# EAGLE design Measure-02 (EAGLE 6.2)
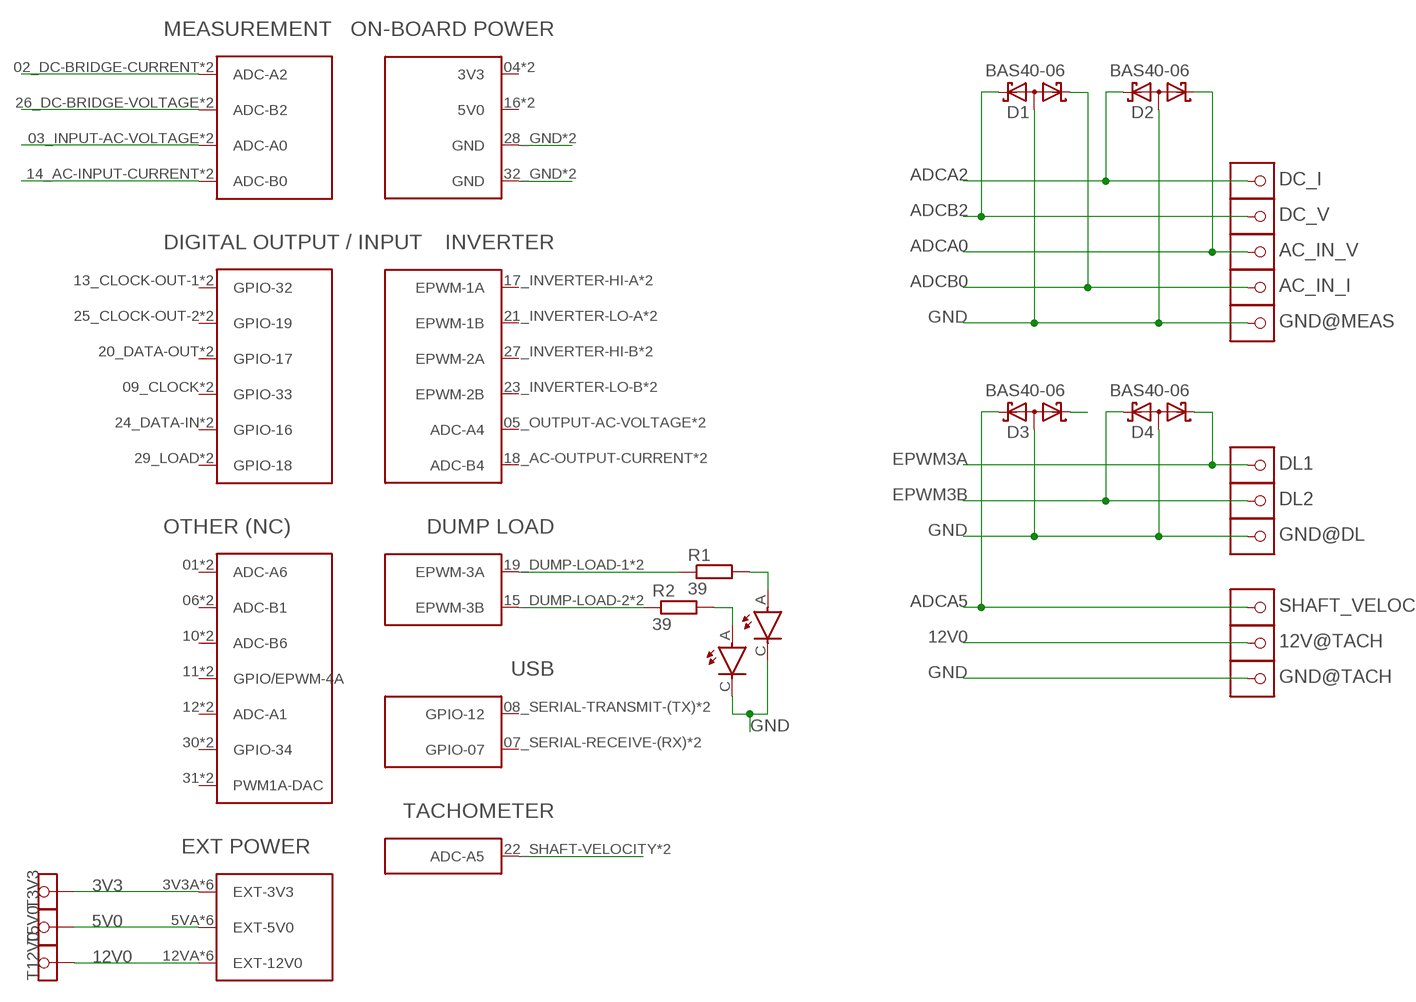
[diagram p0: schematic, sheet 1]

## Parts
12V@TACH  1X1HEADER(W/VIA)  [1X1HEADER(W/VIA)]
AC_IN_I  1X1HEADER(W/VIA)  [1X1HEADER(W/VIA)]
AC_IN_V  1X1HEADER(W/VIA)  [1X1HEADER(W/VIA)]
D1  BAS40-06  [SOT23]
D2  BAS40-06  [SOT23]
D3  BAS40-06  [SOT23]
D4  BAS40-06  [SOT23]
DC_I  1X1HEADER(W/VIA)  [1X1HEADER(W/VIA)]
DC_V  1X1HEADER(W/VIA)  [1X1HEADER(W/VIA)]
DL1  1X1HEADER(W/VIA)  [1X1HEADER(W/VIA)]
DL2  1X1HEADER(W/VIA)  [1X1HEADER(W/VIA)]
DL.1  PLCC2  [PLCC2]
DL.2  PLCC2  [PLCC2]
GND@DL  1X1HEADER(W/VIA)  [1X1HEADER(W/VIA)]
GND@MEAS  1X1HEADER(W/VIA)  [1X1HEADER(W/VIA)]
GND@TACH  1X1HEADER(W/VIA)  [1X1HEADER(W/VIA)]
R1  39  R-EU_R0805  [R0805]
R2  39  R-EU_R0805  [R0805]
SHAFT_VELOC  1X1HEADER(W/VIA)  [1X1HEADER(W/VIA)]
T3V3  TESTPAD  [TESTPAD]
T5V0  TESTPAD  [TESTPAD]
T12V0  TESTPAD  [TESTPAD]
U$1  CONTROLLER_STACK  [CONTROLLER_STACK]

## Nets
3V3: T3V3.TP U$1.3V3A(EXT-3V3) U$1.3V3B(EXT-3V3) U$1.3V3C(EXT-3V3) U$1.3V3D(EXT-3V3) U$1.3V3E(EXT-3V3) U$1.3V3F(EXT-3V3)
5V0: T5V0.TP U$1.5VA(EXT-5V0) U$1.5VB(EXT-5V0) U$1.5VC(EXT-5V0) U$1.5VD(EXT-5V0) U$1.5VE(EXT-5V0) U$1.5VF(EXT-5V0)
12V0: 12V@TACH.P$2 12V@TACH.P$3 12V@TACH.P$4 12V@TACH.PAD T12V0.TP U$1.12VA(EXT-12V0) U$1.12VB(EXT-12V0) U$1.12VC(EXT-12V0) U$1.12VD(EXT-12V0) U$1.12VE(EXT-12V0) U$1.12VF(EXT-12V0)
ADCA0: AC_IN_V.P$2 AC_IN_V.P$3 AC_IN_V.P$4 AC_IN_V.PAD D2.1(K1) U$1.03_INPUT-AC-VOLTAGE(ADC-A0) U$1.C3(ADC-A0)
ADCA2: D2.2(K2) DC_I.P$2 DC_I.P$3 DC_I.P$4 DC_I.PAD U$1.02_DC-BRIDGE-CURRENT(ADC-A2) U$1.C2(ADC-A2)
ADCA5: D3.2(K2) SHAFT_VELOC.P$2 SHAFT_VELOC.P$3 SHAFT_VELOC.P$4 SHAFT_VELOC.PAD U$1.22_SHAFT-VELOCITY(ADC-A5) U$1.C22(ADC-A5)
ADCB0: AC_IN_I.P$2 AC_IN_I.P$3 AC_IN_I.P$4 AC_IN_I.PAD D1.1(K1) U$1.14_AC-INPUT-CURRENT(ADC-B0) U$1.C14(ADC-B0)
ADCB2: D1.2(K2) DC_V.P$2 DC_V.P$3 DC_V.P$4 DC_V.PAD U$1.26_DC-BRIDGE-VOLTAGE(ADC-B2) U$1.C26(ADC-B2)
EPWM3A: D4.1(K1) DL1.P$2 DL1.P$3 DL1.P$4 DL1.PAD R1.1 U$1.19_DUMP-LOAD-1(EPWM-3A) U$1.C19(EPWM-3A)
EPWM3B: D4.2(K2) DL2.P$2 DL2.P$3 DL2.P$4 DL2.PAD R2.1 U$1.15_DUMP-LOAD-2(EPWM-3B) U$1.C15(EPWM-3B)
GND: D1.3(AA) D2.3(AA) D3.3(AA) D4.3(AA) DL.1.C DL.2.C GND@DL.P$2 GND@DL.P$3 GND@DL.P$4 GND@DL.PAD GND@MEAS.P$2 GND@MEAS.P$3 GND@MEAS.P$4 GND@MEAS.PAD GND@TACH.P$2 GND@TACH.P$3 GND@TACH.P$4 GND@TACH.PAD U$1.28_GND(GND) U$1.32_GND(GND) U$1.C28(GND) U$1.C32(GND)
N$1: DL.2.A R2.2
N$2: DL.1.A R1.2
STARTUP: D3.1(K1)
Unconnected: U$1.01(ADC-A6) U$1.04(3V3) U$1.05_OUTPUT-AC-VOLTAGE(ADC-A4) U$1.06(ADC-B1) U$1.07_SERIAL-RECEIVE-(RX)(GPIO-07) U$1.08_SERIAL-TRANSMIT-(TX)(GPIO-12) U$1.09_CLOCK(GPIO-33) U$1.10(ADC-B6) U$1.11(GPIO/EPWM-4A) U$1.12(ADC-A1) U$1.13_CLOCK-OUT-1(GPIO-32) U$1.16(5V0) U$1.17_INVERTER-HI-A(EPWM-1A) U$1.18_AC-OUTPUT-CURRENT(ADC-B4) U$1.20_DATA-OUT(GPIO-17) U$1.21_INVERTER-LO-A(EPWM-1B) U$1.23_INVERTER-LO-B(EPWM-2B) U$1.24_DATA-IN(GPIO-16) U$1.25_CLOCK-OUT-2(GPIO-19) U$1.27_INVERTER-HI-B(EPWM-2A) U$1.29_LOAD(GPIO-18) U$1.30(GPIO-34) U$1.31(PWM1A-DAC) U$1.C1(ADC-A6) U$1.C4(3V3) U$1.C5(ADC-A4) U$1.C6(ADC-B1) U$1.C7(GPIO-07) U$1.C8(GPIO-12) U$1.C9(GPIO-33) U$1.C10(ADC-B6) U$1.C11(GPIO/EPWM-4A) U$1.C12(ADC-A1) U$1.C13(GPIO-32) U$1.C16(5V0) U$1.C17(EPWM-1A) U$1.C18(ADC-B4) U$1.C20(GPIO-17) U$1.C21(EPWM-1B) U$1.C23(EPWM-2B) U$1.C24(GPIO-16) U$1.C25(GPIO-19) U$1.C27(EPWM-2A) U$1.C29(GPIO-18) U$1.C30(GPIO-34) U$1.C31(PWM1A-DAC)

## Library data of the parts
12V@TACH AC_IN_I AC_IN_V DC_I DC_V DL1 DL2 GND@DL GND@MEAS GND@TACH SHAFT_VELOC = headers v6-2:1X1HEADER(W/VIA)
D1-D4 = diode:BAS40-06: Silicon Schottky Diodes General-purpose diode for high-speed switching
DL.1 DL.2 = PCB_ControlStack:PLCC2
R1 R2 = resistor:R-EU_: RESISTOR, European symbol
T3V3 T5V0 T12V0 = PCB_ControlStack:TESTPAD
U$1 = PCB_ControlStack:CONTROLLER_STACK

## Board
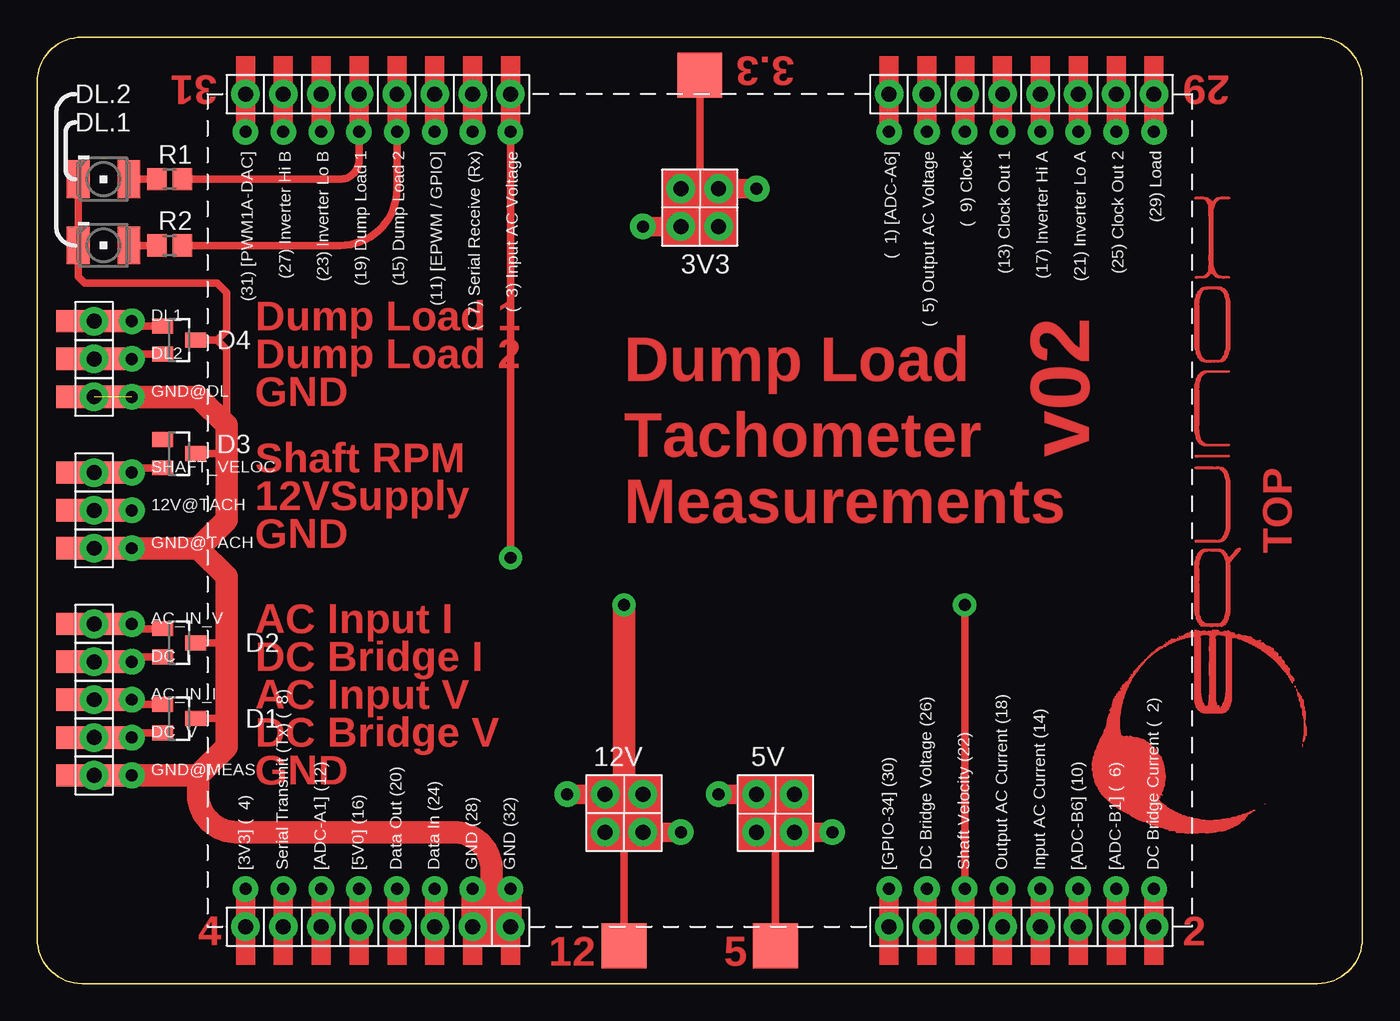
[diagram p1: board, top side]
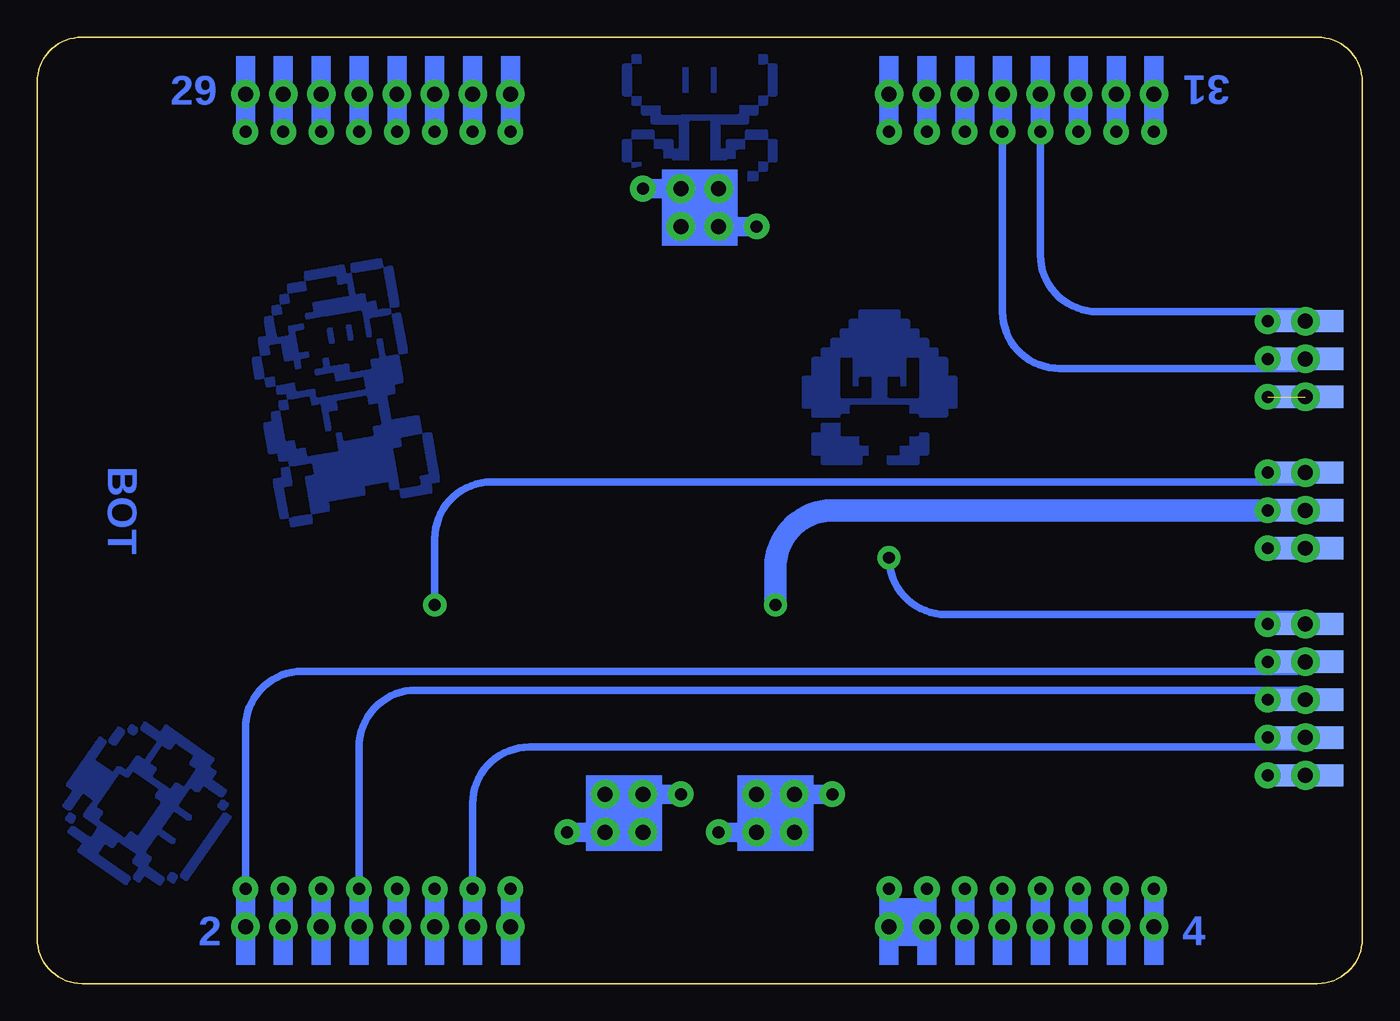
[diagram p2: board, bottom side, seen from below]

Size 88.9 x 63.5 mm. Coordinates in mm from the lower left corner, seen from the top.
Outline: 3,0 85.9,0 arc90 88.9,3 88.9,60.5 arc90 85.9,63.5 3,63.5 arc90 0,60.5 0,3 arc90 3,0
Copper layers (1*16): Top 0.035mm / dielectric 1.5mm / Bottom 0.035mm
Design rules: minimum track width 12mil, minimum drill 0.7mm, track to track 25mil, track to pad 20mil, pad to pad 15mil, via to via 20mil, smd to smd 0mil, copper to edge 40mil, drill to drill 10mil, minimum pad ring 18mil, minimum via ring 15mil, stop-mask expansion 0mil, vias tented up to drill 0mil, thermal gap 15mil
tRestrict: 8 lines
bRestrict: area 65.3,45.3 to 67.7,47.9; area 65.9,36.5 to 69.2,39.3; area 66,39.4 to 73.8,44.6; area 66.9,42.9 to 69.7,45.1; area 68.1,43.5 to 73,47.4; area 64.8,42.2 to 66.5,44.8; area 70.5,31.4 to 72.2,34.8; area 62.7,33.3 to 64.9,36.8; area 68.8,35.5 to 72.5,39.3; area 29.8,35.6 to 34.9,38.7; area 33,39.4 to 34.9,41.9; area 29.8,39.4 to 31.8,41.9; 13 more areas; 8 lines

### Footprints (pad centres in the part's own frame; a part is rotated, then mirrored left to right if it is on the bottom)
1X1HEADER(W/VIA) = smd 5.08 x 1.5: P$2 0,0 | smd 5.08 x 1.5 bottom: P$3 0,0 | drill 0.8: P$4 2.54,0 | drill 1: PAD 0,0
SOT23 = smd 1 x 1.4: 1 -0.95,-1.1; 2 0.95,-1.1; 3 0,1.1
PLCC2 = smd 2.54 x 1.524: A 0,1.702; C 0,-1.702
R0805 = smd 1.3 x 1.5: 1 -0.85,0; 2 0.85,0
TESTPAD = smd 3 x 3: TP 0,0
CONTROLLER_STACK = drill 1: 01 -27.94,12.7; 02_DC-BRIDGE-CURRENT 27.94,30.48; 03_INPUT-AC-VOLTAGE -27.94,-12.7; 3V3B -21.59,-1.27; 3V3C -21.59,1.27; 3V3E -19.05,1.27; 3V3F -19.05,-1.27; 04 27.94,-30.48; 05_OUTPUT-AC-VOLTAGE -27.94,15.24; 5VB 19.05,3.81; 5VC 19.05,6.35; 5VE 21.59,6.35; 5VF 21.59,3.81; 06 27.94,27.94; 07_SERIAL-RECEIVE-(RX) -27.94,-15.24; 08_SERIAL-TRANSMIT-(TX) 27.94,-27.94; 09_CLOCK -27.94,17.78; 10 27.94,25.4; 11 -27.94,-17.78; 12 27.94,-25.4; 12VB 19.05,-6.35; 12VC 19.05,-3.81; 12VE 21.59,-3.81; 12VF 21.59,-6.35; 13_CLOCK-OUT-1 -27.94,20.32; 14_AC-INPUT-CURRENT 27.94,22.86; 15_DUMP-LOAD-2 -27.94,-20.32; 16 27.94,-22.86; 17_INVERTER-HI-A -27.94,22.86; 18_AC-OUTPUT-CURRENT 27.94,20.32; 19_DUMP-LOAD-1 -27.94,-22.86; 20_DATA-OUT 27.94,-20.32; 21_INVERTER-LO-A -27.94,25.4; 22_SHAFT-VELOCITY 27.94,17.78; 23_INVERTER-LO-B -27.94,-25.4; 24_DATA-IN 27.94,-17.78; 25_CLOCK-OUT-2 -27.94,27.94; 26_DC-BRIDGE-VOLTAGE 27.94,15.24; 27_INVERTER-HI-B -27.94,-27.94; 28_GND 27.94,-15.24; 29_LOAD -27.94,30.48; 30 27.94,12.7; 31 -27.94,-30.48; 32_GND 27.94,-12.7 | drill 0.8: 3V3A -21.59,3.81; 3V3D -19.05,-3.81; 5VA 19.05,1.27; 5VD 21.59,8.89; 12VA 19.05,-8.89; 12VD 21.59,-1.27; C1 -25.4,12.7; C2 25.4,30.48; C3 -25.4,-12.7; C4 25.4,-30.48; C5 -25.4,15.24; C6 25.4,27.94; C7 -25.4,-15.24; C8 25.4,-27.94; C9 -25.4,17.78; C10 25.4,25.4; C11 -25.4,-17.78; C12 25.4,-25.4; C13 -25.4,20.32; C14 25.4,22.86; C15 -25.4,-20.32; C16 25.4,-22.86; C17 -25.4,22.86; C18 25.4,20.32; C19 -25.4,-22.86; C20 25.4,-20.32; C21 -25.4,25.4; C22 25.4,17.78; C23 -25.4,-25.4; C24 25.4,-17.78; C25 -25.4,27.94; C26 25.4,15.24; C27 -25.4,-27.94; C28 25.4,-15.24; C29 -25.4,30.48; C30 25.4,12.7; C31 -25.4,-30.48; C32 25.4,-12.7

### Placement (x,y rotation side)
12V@TACH  3.81,31.75 0 top
AC_IN_I  3.81,19.05 0 top
AC_IN_V  3.81,24.13 0 top
D1  9.53,17.78 270 top
D2  9.53,22.86 270 top
D3  9.53,35.56 270 top
D4  9.53,43.18 270 top
DC_I  3.81,21.59 0 top
DC_V  3.81,16.51 0 top
DL1  3.81,44.45 0 top
DL2  3.81,41.91 0 top
DL.1  4.45,53.98 270 top
DL.2  4.45,49.53 270 top
GND@DL  3.81,39.37 0 top
GND@MEAS  3.81,13.97 0 top
GND@TACH  3.81,29.21 0 top
R1  8.89,53.98 180 top
R2  8.89,49.53 180 top
SHAFT_VELOC  3.81,34.29 0 top
T3V3  44.45,60.96 0 top
T5V0  49.53,2.54 180 top
T12V0  39.37,2.54 180 top
U$1  44.45,31.75 270 top

### Tracks (layer width: path | path; a pad name or v marks a point on that pad's centre or on a via)
3V3
  Top 0.5: T3V3.TP 44.45,53.34 U$1.3V3C
  Bottom 0.5: U$1.3V3D U$1.3V3F U$1.3V3B U$1.3V3C | U$1.3V3A U$1.3V3C | U$1.3V3E U$1.3V3C
5V0
  Top 0.5: U$1.5VA U$1.5VB U$1.5VC U$1.5VE | U$1.5VF 49.53,10.16 | 49.53,10.16 U$1.5VE | U$1.5VE U$1.5VD | T5V0.TP 49.53,10.16
12V0  (via drill 0.8)
  Top 0.5: U$1.12VA U$1.12VB U$1.12VC U$1.12VE | U$1.12VD U$1.12VE | U$1.12VF 39.37,10.16 | 39.37,10.16 U$1.12VE | T12V0.TP 39.37,10.16
  Top 1.5: v39.37,25.4 39.37,10.16
  Bottom 1.5: 12V@TACH.PAD 12V@TACH.P$4 35.56,31.75 arc-90 39.37,27.94 v39.37,25.4
ADCA0  (via drill 0.8)
  Top 0.5: v31.75,28.57 U$1.C3 U$1.03_INPUT-AC-VOLTAGE | D2.1 4.13,23.81 arc-90 AC_IN_V.PAD
  Bottom 0.5: 6.99,24.77 27.94,24.77 arc90 v31.75,28.57 | 6.99,24.77 arc90 AC_IN_V.P$4 | 6.99,24.77 4.45,24.77 arc90 AC_IN_V.PAD
ADCA2
  Top 0.5: D2.2 4.13,21.91 arc90 DC_I.PAD
  Bottom 0.5: 6.99,20.95 71.12,20.95 arc-90 74.93,17.14 U$1.C2 U$1.02_DC-BRIDGE-CURRENT | 6.99,20.95 arc-90 DC_I.P$4 | 6.99,20.95 4.45,20.95 arc-90 DC_I.PAD
ADCA5  (via drill 0.8)
  Top 0.5: D3.2 4.13,34.61 arc90 SHAFT_VELOC.PAD | v62.23,25.4 U$1.C22 U$1.22_SHAFT-VELOCITY
  Bottom 0.5: 6.99,33.66 58.42,33.66 arc-90 62.23,29.84 v62.23,25.4 | 6.99,33.66 arc-90 SHAFT_VELOC.P$4 | 6.99,33.66 4.45,33.66 arc-90 SHAFT_VELOC.PAD
ADCB0
  Top 0.5: D1.1 4.13,18.73 arc-90 AC_IN_I.PAD
  Bottom 0.5: AC_IN_I.P$4 arc-90 6.99,19.68 | 6.99,19.68 63.5,19.68 arc-90 67.31,15.88 U$1.C14 U$1.14_AC-INPUT-CURRENT | 6.99,19.68 4.45,19.68 arc90 AC_IN_I.PAD
ADCB2
  Top 0.5: D1.2 4.13,16.83 arc90 DC_V.PAD
  Bottom 0.5: DC_V.P$4 arc90 6.99,15.88 | 6.99,15.88 55.88,15.88 arc-90 59.69,12.06 U$1.C26 U$1.26_DC-BRIDGE-VOLTAGE | 6.99,15.88 4.45,15.88 arc-90 DC_V.PAD
EPWM3A
  Top 0.5: U$1.19_DUMP-LOAD-1 U$1.C19 21.59,55.24 arc-90 20.32,53.98 R1.1 | D4.1 4.13,44.13 arc-90 DL1.PAD
  Bottom 0.5: 6.99,45.09 17.78,45.09 arc90 21.59,48.9 U$1.C19 | 6.99,45.09 arc90 DL1.P$4 | 6.99,45.09 4.45,45.09 arc90 DL1.PAD
EPWM3B
  Top 0.5: U$1.15_DUMP-LOAD-2 U$1.C15 24.13,53.34 arc-90 20.32,49.53 R2.1 | D4.2 4.13,42.23 arc90 DL2.PAD
  Bottom 0.5: 6.99,41.27 20.32,41.27 arc90 24.13,45.09 U$1.C15 | 6.99,41.27 arc-90 DL2.P$4 | 6.99,41.27 4.45,41.27 arc-90 DL2.PAD
GND  (1 unrouted)
  Top 0.5: D1.3 12.7,17.78 | D3.3 12.7,35.56 | D2.3 12.7,22.86 | D4.3 12.06,43.18 | 12.06,43.18 12.7,42.55 12.7,37.47 | DL.1.C DL.2.C 2.74,47.42 3.17,46.99 12.06,46.99 12.7,46.35 12.7,43.81 12.06,43.18
  Top 1.5: GND@MEAS.PAD GND@MEAS.P$4 10.79,13.97 | U$1.C28 U$1.28_GND 30.48,3.81 | 10.79,29.21 12.7,27.3 12.7,22.86 12.7,17.78 12.7,15.88 10.79,13.97 | GND@TACH.PAD GND@TACH.P$4 10.79,29.21 | GND@DL.P$4 10.79,39.37 12.7,37.47 12.7,35.56 12.7,31.11 10.79,29.21 | U$1.C32 U$1.32_GND 30.48,3.81 | 30.48,3.81 30.48,7.62 arc90 27.94,10.16 13.34,10.16 arc-90 10.79,12.7 10.79,13.97
  Bottom 1.5: 30.48,3.81 U$1.28_GND
N$1
  Top 0.5: R2.2 DL.2.A
N$2
  Top 0.5: R1.2 DL.1.A
N$3
  pour Bottom: 36.83,35.56 36.83,36.83 36.2,36.83 36.2,37.47 34.92,37.47 34.92,38.1 36.83,38.1 36.83,38.73 37.47,38.73 37.47,40.64 36.83,40.64 36.83,41.91 36.2,41.91 36.2,42.55 35.56,42.55 35.56,43.18 34.92,43.18 34.92,43.81 34.29,43.81 34.29,44.45 33.66,44.45 33.66,45.09 31.11,45.09 31.11,44.45 30.48,44.45 30.48,43.81 29.84,43.81 29.84,43.18 29.21,43.18 29.21,42.55 28.57,42.55 28.57,41.91 27.94,41.91 27.94,40.64 27.3,40.64 27.3,38.73 27.94,38.73 27.94,38.1 29.84,38.1 29.84,36.83 29.21,36.83 29.21,35.56 29.84,35.56 29.84,34.92 31.75,34.92 31.75,35.56 33.66,35.56 33.66,34.92 36.2,34.92 36.2,35.56
N$4
  pour Bottom: 82.97,6.73 86.09,8.92 85.72,9.44 86.76,10.17 86.4,10.69 86.92,11.05 86.56,11.57 87.08,11.94 86.35,12.98 86.87,13.34 84.68,16.46 84.16,16.1 83.43,17.14 82.91,16.77 82.55,17.29 82.03,16.93 81.67,17.45 80.62,16.72 80.26,17.24 77.14,15.06 77.5,14.54 76.98,14.17 77.35,13.65 76.31,12.92 76.67,12.4 76.15,12.04 76.52,11.52 76,11.15 78.91,6.99 79.43,7.36 79.79,6.84 80.31,7.2 80.68,6.68 81.72,7.41 82.08,6.89 82.6,7.25
N$5
  pour Bottom: 46.99,63.5 41.91,63.5 41.91,62.87 40.64,62.87 40.64,62.23 40.01,62.23 40.01,61.59 39.37,61.59 39.37,59.69 40.01,59.69 40.01,59.05 40.64,59.05 40.64,58.42 41.27,58.42 41.27,57.78 43.18,57.78 43.18,55.88 42.55,55.88 42.55,56.52 41.27,56.52 41.27,57.15 40.01,57.15 40.01,56.52 39.37,56.52 39.37,55.24 40.01,55.24 40.01,54.61 40.64,54.61 40.64,53.98 41.91,53.98 41.91,53.34 46.99,53.34 46.99,53.98 48.26,53.98 48.26,54.61 48.9,54.61 48.9,55.24 49.53,55.24 49.53,56.52 48.9,56.52 48.9,57.15 47.62,57.15 47.62,56.52 46.35,56.52 46.35,55.88 45.72,55.88 45.72,57.78 47.62,57.78 47.62,58.42 48.26,58.42 48.26,59.05 48.9,59.05 48.9,59.69 49.53,59.69 49.53,61.59 48.9,61.59 48.9,62.23 48.26,62.23 48.26,62.87 46.99,62.87
N$34
  pour Bottom: 74.17,40.64 74.39,41.89 73.77,42 73.99,43.25 73.36,43.36 73.58,44.61 72.96,44.72 73.07,45.35 72.44,45.46 72.55,46.08 71.93,46.19 72.04,46.82 70.79,47.04 70.9,47.66 68.4,48.1 68.29,47.48 67.66,47.59 67.77,48.22 65.89,48.55 65.78,47.92 65.16,48.03 64.72,45.53 65.34,45.42 65.23,44.79 64.61,44.9 64.17,42.4 64.79,42.29 64.46,40.42 65.09,40.31 64.98,39.68 65.6,39.57 65.27,37.69 63.39,38.03 63.17,36.77 62.55,36.88 62,33.76 62.62,33.65 62.51,33.02 64.39,32.69 64.5,33.32 65.12,33.21 65.23,33.83 67.11,33.5 67,32.88 69.5,32.43 69.39,31.81 70.64,31.59 70.53,30.96 71.78,30.74 71.89,31.37 72.52,31.26 72.96,33.76 72.33,33.87 72.44,34.5 71.82,34.61 71.93,35.23 72.55,35.12 72.66,35.75 73.29,35.64 73.62,37.51 73,37.62 73.11,38.25 72.48,38.36 72.59,38.98 71.96,39.09 72.08,39.72 72.7,39.61 72.81,40.23 73.44,40.12 73.55,40.75
(copper drawn outside any net)
  shapes: Bottom area x1, Top area x2019

### Text on the board
Top: 3.3 | Dump Load 1 | Dump Load | Dump Load 2 | v02 | GND | Tachometer | Shaft RPM | 12VSupply | Measurements | TOP | GND | AC Input I | DC Bridge I | AC Input V | DC Bridge V | GND | 12 | 5
Bottom: BOT